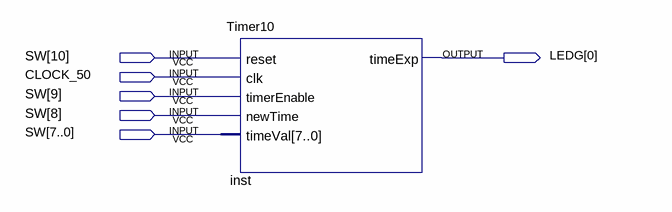
[diagram p0: schematic sheet]
// Quartus schematic Timer10Block.bdf as structural Verilog: 1 symbols, 6 pins
module Timer10Block (
  input  [10:0] SW,
  input  CLOCK_50,
  output [0:0] LEDG
);

  Timer10 inst (
    .reset(SW[10]), .clk(CLOCK_50), .timerEnable(SW[9]), .newTime(SW[8]), .timeVal(SW[7:0]), .timeExp(LEDG[0]));
endmodule
